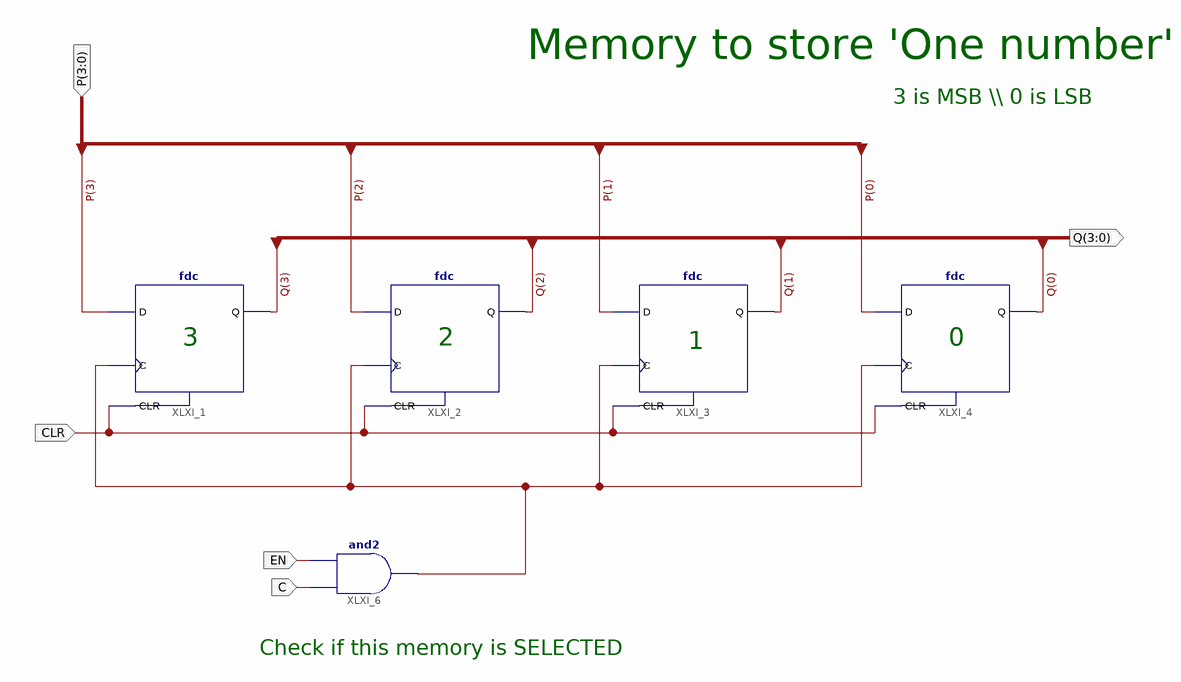
[diagram p0: schematic sheet 1]
// Xilinx ISE schematic memo.sch (spartan6) as structural Verilog: 5 symbols, 5 ports
module memo (
  input  CLR,
  input  EN,
  input  C,
  input  [3:0] P,
  output [3:0] Q
);

  wire XLXN_28;

  fdc XLXI_4 (.C(XLXN_28), .CLR(CLR), .D(P[0]), .Q(Q[0]));
  fdc XLXI_3 (.C(XLXN_28), .CLR(CLR), .D(P[1]), .Q(Q[1]));
  fdc XLXI_2 (.C(XLXN_28), .CLR(CLR), .D(P[2]), .Q(Q[2]));
  fdc XLXI_1 (.C(XLXN_28), .CLR(CLR), .D(P[3]), .Q(Q[3]));
  and XLXI_6 (XLXN_28, C, EN);

  // Notes on the sheet:
  //   Memory to store 'One number'
  //   3 is MSB \\ 0 is LSB
  //   3
  //   2
  //   0
  //   1
  //   Check if this memory is SELECTED
endmodule
